# Altium schematic sheet HUB_USB.SchDoc
size A3; SheetNumber: 13; SheetTotal: 24
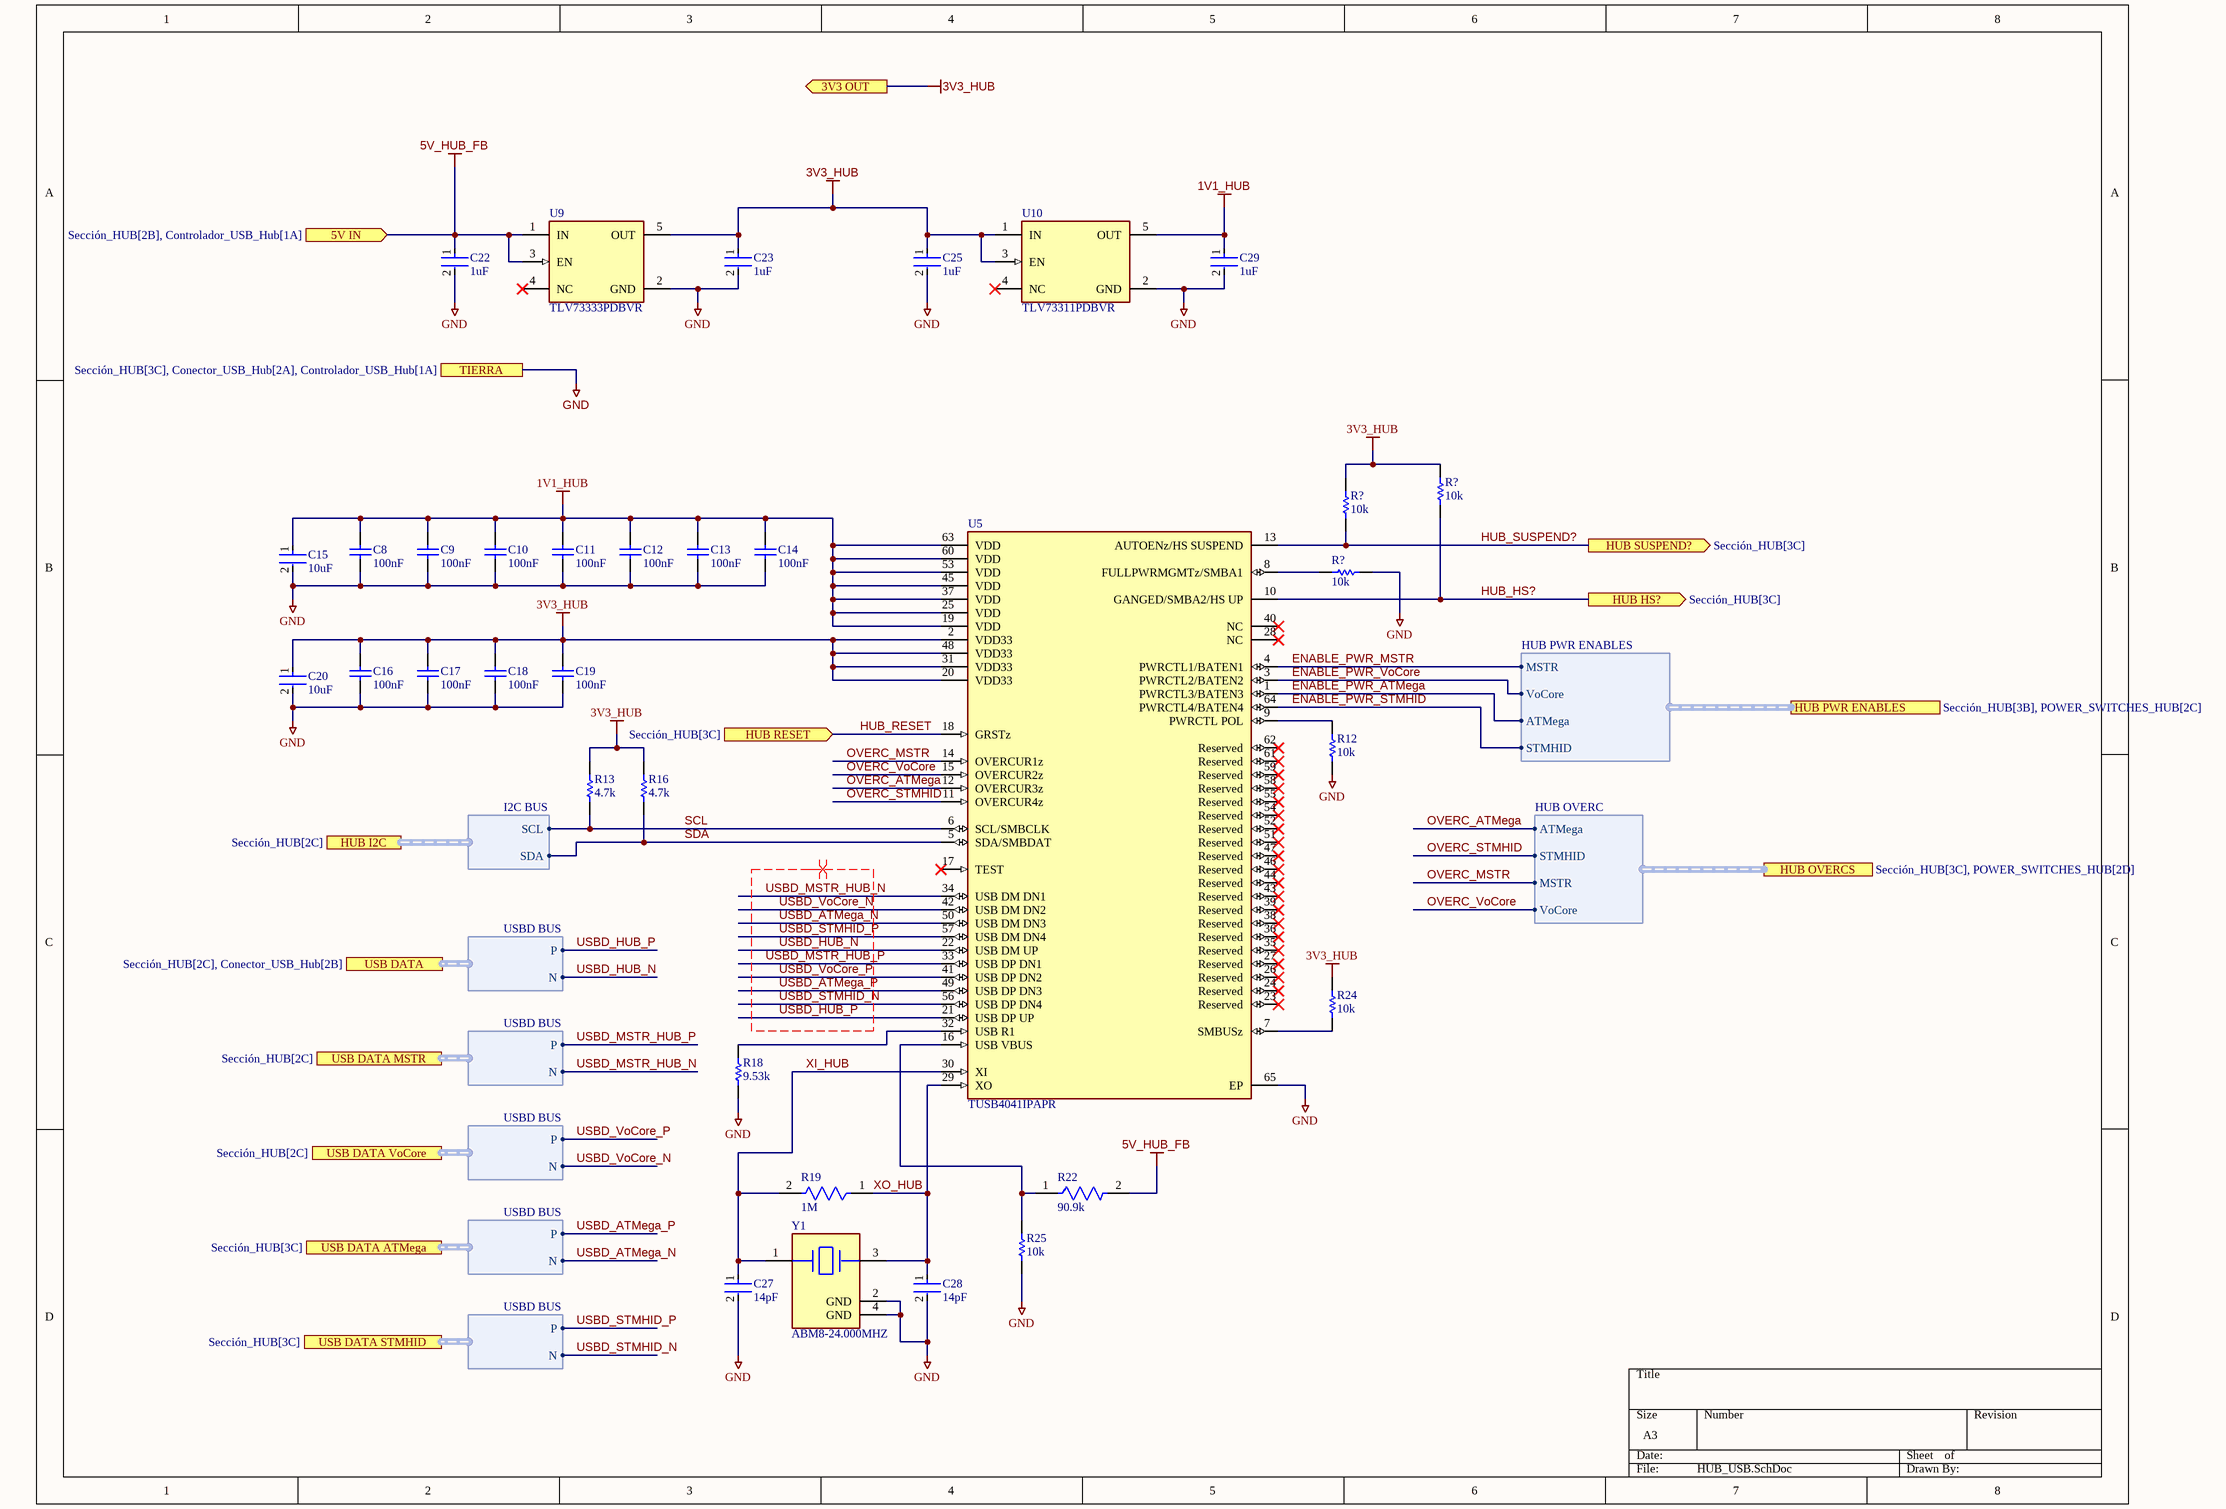
[diagram p0: HUB_USB.SchDoc]

## Parts
(Parts that share a designator on the sheet are numbered #1, #2 ... from top to bottom, then left to right.)
C8  100nF  [CAPC1005X55X25NL05T05]
C9  100nF  [CAPC1005X55X25NL05T05]
C10  100nF  [CAPC1005X55X25NL05T05]
C11  100nF  [CAPC1005X55X25NL05T05]
C12  100nF  [CAPC1005X55X25NL05T05]
C13  100nF  [CAPC1005X55X25NL05T05]
C14  100nF  [CAPC1005X55X25NL05T05]
C15  10uF  [FP-GRM155-0_2-MFG]
C16  100nF  [CAPC1005X55X25NL05T05]
C17  100nF  [CAPC1005X55X25NL05T05]
C18  100nF  [CAPC1005X55X25NL05T05]
C19  100nF  [CAPC1005X55X25NL05T05]
C20  10uF  [FP-GRM155-0_2-MFG]
C22  1uF  [FP-C0402C-BB-IPC_B]
C23  1uF  [FP-C0402C-BB-IPC_B]
C25  1uF  [FP-C0402C-BB-IPC_B]
C27  14pF  [FP-GJM155-0_05-IPC_C]
C28  14pF  [FP-GJM155-0_05-IPC_C]
C29  1uF  [FP-C0402C-BB-IPC_B]
R12  10k  [RESC1005X40X25NL05T05]
R13  4.7k  [RESC1005X40X25ML05T10]
R16  4.7k  [RESC1005X40X25ML05T10]
R18  9.53k  [RESC1609X50X30NL10T20]
R19  1M  [FP-CRCW0402-C-e3-IPC_B]
R22  90.9k  [FP-RK73H1E-IPC_C]
R24  10k  [RESC1005X40X25NL05T05]
R25  10k  [RESC1005X40X25NL05T05]
R?#1  10k  [RESC1005X40X25ML05T05]
R?#2  10k  [RESC1005X40X25ML05T05]
R?#3  10k  [RESC1005X40X25ML05T05]
U5  TUSB4041IPAPR  [FP-PAP0064K-MFG]
U9  TLV73333PDBVR  [FP-DBV0005A-MFG]
U10  TLV73311PDBVR  [FP-DBV0005A-IPC_C]
Y1  ABM8-24.000MHZ  [FP-ABM8-MFG]

## Ports
3V3 OUT (out), 5V IN (in, see Sección_HUB[2B], Controlador_USB_Hub[1A]), HUB HS? (out, see Sección_HUB[3C]), HUB I2C (harness I2C BUS, see Sección_HUB[2C]), HUB OVERCS (harness HUB OVERC, see Sección_HUB[3C], POWER_SWITCHES_HUB[2D]), HUB PWR ENABLES (harness HUB PWR ENABLES, see Sección_HUB[3B], POWER_SWITCHES_HUB[2C]), HUB RESET (in, see Sección_HUB[3C]), HUB SUSPEND? (out, see Sección_HUB[3C]), TIERRA (see Sección_HUB[3C], Conector_USB_Hub[2A], Controlador_USB_Hub[1A]), USB DATA (harness USBD BUS, see Sección_HUB[2C], Conector_USB_Hub[2B]), USB DATA ATMega (harness USBD BUS, see Sección_HUB[3C]), USB DATA MSTR (harness USBD BUS, see Sección_HUB[2C]), USB DATA STMHID (harness USBD BUS, see Sección_HUB[3C]), USB DATA VoCore (harness USBD BUS, see Sección_HUB[2C])

## Harnesses
I2C BUS: SDA, SCL
HUB PWR ENABLES: ATMega, STMHID, MSTR, VoCore
HUB OVERC: ATMega, STMHID, MSTR, VoCore
USBD BUS: P, N

## Nets
1V1_HUB: C8.2 C9.2 C10.2 C11.2 C12.2 C13.2 C14.2 C15.1 C29.1 U5.19(VDD) U5.25(VDD) U5.37(VDD) U5.45(VDD) U5.53(VDD) U5.60(VDD) U5.63(VDD) U10.5(OUT)
3V3_HUB: C16.2 C17.2 C18.2 C19.2 C20.1 C23.1 C25.1 R13.2 R16.2 R24.2 R?#1.2 R?#2.2 U5.2(VDD33) U5.20(VDD33) U5.31(VDD33) U5.48(VDD33) U9.5(OUT) U10.1(IN) U10.3(EN) ; port 3V3 OUT
5V_HUB_FB: C22.1 R22.2 U9.1(IN) U9.3(EN) ; port 5V IN
GND: C8.1 C9.1 C10.1 C11.1 C12.1 C13.1 C14.1 C15.2 C16.1 C17.1 C18.1 C19.1 C20.2 C22.2 C23.2 C25.2 C27.2 C28.2 C29.2 R12.1 R18.1 R25.1 R?#3.1 U5.65(EP) U9.2(GND) U10.2(GND) Y1.2(GND) Y1.4(GND) ; port TIERRA
ENABLE_PWR_ATMega: U5.1(PWRCTL3/BATEN3) ; port HUB PWR ENABLES.ATMega
ENABLE_PWR_MSTR: U5.4(PWRCTL1/BATEN1) ; port HUB PWR ENABLES.MSTR
ENABLE_PWR_STMHID: U5.64(PWRCTL4/BATEN4) ; port HUB PWR ENABLES.STMHID
ENABLE_PWR_VoCore: U5.3(PWRCTL2/BATEN2) ; port HUB PWR ENABLES.VoCore
HUB_HS?: R?#1.1 U5.10(GANGED/SMBA2/HS_UP) ; port HUB HS?
HUB_RESET: U5.18(GRSTz) ; port HUB RESET
HUB_SUSPEND?: R?#2.1 U5.13(AUTOENz/HS_SUSPEND) ; port HUB SUSPEND?
OVERC_ATMega: U5.12(OVERCUR3z) ; port HUB OVERCS.ATMega
OVERC_MSTR: U5.14(OVERCUR1z) ; port HUB OVERCS.MSTR
OVERC_STMHID: U5.11(OVERCUR4z) ; port HUB OVERCS.STMHID
OVERC_VoCore: U5.15(OVERCUR2z) ; port HUB OVERCS.VoCore
SCL: R13.1 U5.6(SCL/SMBCLK) ; port HUB I2C.SCL
SDA: R16.1 U5.5(SDA/SMBDAT) ; port HUB I2C.SDA
USBD_ATMega_N: U5.50(USB_DM_DN3) ; port USB DATA ATMega.N
USBD_ATMega_P: U5.49(USB_DP_DN3) ; port USB DATA ATMega.P
USBD_HUB_N: U5.22(USB_DM_UP) ; port USB DATA.N
USBD_HUB_P: U5.21(USB_DP_UP) ; port USB DATA.P
USBD_MSTR_HUB_N: U5.34(USB_DM_DN1) ; port USB DATA MSTR.N
USBD_MSTR_HUB_P: U5.33(USB_DP_DN1) ; port USB DATA MSTR.P
USBD_STMHID_N: U5.56(USB_DP_DN4) ; port USB DATA STMHID.N
USBD_STMHID_P: U5.57(USB_DM_DN4) ; port USB DATA STMHID.P
USBD_VoCore_N: U5.42(USB_DM_DN2) ; port USB DATA VoCore.N
USBD_VoCore_P: U5.41(USB_DP_DN2) ; port USB DATA VoCore.P
XI_HUB: C27.1 R19.2 U5.30(XI) Y1.1
XO_HUB: C28.1 R19.1 U5.29(XO) Y1.3
NetR12_2: R12.2 U5.9(PWRCTL_POL)
NetR18_2: R18.2 U5.32(USB_R1)
NetR22_1: R22.1 R25.2 U5.16(USB_VBUS)
NetR24_1: R24.1 U5.7(SMBUSz)
NetR?#3_2: R?#3.2 U5.8(FULLPWRMGMTz/SMBA1)

Not connected (* = marked no-connect by the designer): U5 17(TEST)* 23(Reserved)* 24(Reserved)* 26(Reserved)* 27(Reserved)* 28(NC)* 35(Reserved)* 36(Reserved)* 38(Reserved)* 39(Reserved)* 40(NC)* 43(Reserved)* 44(Reserved)* 46(Reserved)* 47(Reserved)* 51(Reserved)* 52(Reserved)* 54(Reserved)* 55(Reserved)* 58(Reserved)* 59(Reserved)* 61(Reserved)* 62(Reserved)*; U9 4(NC)*; U10 4(NC)*

## Layout directives
differential pair: USBD_ATMega_N, USBD_ATMega_P, USBD_HUB_N, USBD_HUB_P, USBD_MSTR_HUB_N, USBD_MSTR_HUB_P, USBD_STMHID_N, USBD_STMHID_P, USBD_VoCore_N, USBD_VoCore_P

## Library data of the parts
C8-C14 C16-C19 = CMP-2008-02030-1: Manufacturer: Vitramon; Part Number: VJ0402Y104KXJCW1BC
C15 C20 = CMP-06035-002770-1: Chip Multilayer Ceramic Capacitors for General Purpose, 0402, 10uF, X5R, 15%, 20%, 4V
C22 C23 C25 C29 = CMP-03020-034679-1: CAP CER 1UF 16V X5R 0402; Dielectric Material: Ceramic; Tolerance: 10%; RoHS Compliant: Yes; Voltage Rating (DC): 16V; Voltage Rating: 16V; Max Operating Temperature: 85°C; Packaging: Cut Tape; Width: 0.02inch; Dielectric: X5R; Lead Free: Lead Free; Min Operating Temperature: -55°C; Mount: Surface Mount; Case/Package: 0402; Thickness: 0.022inch; REACH SVHC: No SVHC; Length: 0.039inch; Case Code (Metric): 1005; Case Code (Imperial): 0402; Capacitance: 1uF
C27 C28 = CMP-06035-029519-1: Multi-Layer Ceramic Capacitor 14pF C0G  ±1% 0402 Paper T/R
R12 R24 R25 R?#1-R?#3 = CMP-2002-00601-1: Manufacturer: Panasonic; Part Number: ERJ-2RHD1002X
R13 R16 = CMP-2002-06456-1: Manufacturer: Panasonic; Part Number: ERJ-S02F4701X
R18 = CMP-2000-03655-1: Manufacturer: Vishay Dale; Part Number: CRCW06039K53FKEA
R19 = CMP-02407-013080-1: RES 1M OHM 1% 1/16W 0402; Max Power Dissipation: 63mW; Temperature Coefficient: 100ppm/°C; Power Rating: 62.5mW; Resistance: 1MR; Tolerance: 1%; Contact Plating: Tin; Max Operating Temperature: 155°C; Number of Terminations: 2; Min Operating Temperature: -55°C; Lead Free: Lead Free; Length: 1mm; RoHS Compliant: Yes; Series: CRCW-C; Case/Package: 0402; Packaging: Tape and Reel; Mount: Surface Mount; Resistor Type: Thick Film; Termination: Wraparound
R22 = CMP-04015-083698-1: 90.9kΩ ±1% 0.1W Chip Resistor 0402 Flat Chip (Anti-Sulfuration) AEC-Q200 Qualified; Voltage Rating: 50V; Resistance: 90.9kR; Power Rating: 63mW; Temperature Coefficient: 100ppm/°C; Case Code (Metric): 1005; Tolerance: 1%; Case/Package: 0402; Width: 0.5mm; Case Code (Imperial): 0402; Height: 0.35mm; Weight: 2.3E-05oz; Min Operating Temperature: -55°C; Length: 1mm; RoHS Compliant: Yes; Termination: SMD/SMT; Max Operating Temperature: 155°C; Packaging: Tape and Reel; Package Quantity: 10000
U5 = CMP-04877-000003-1: IC USB 2.0 4PORT HUB 64HTQFP; Manufacturer: Texas Instruments; Interface: I2C,USB,SMBus; Max Supply Voltage: 3.6V; Nominal Supply Current: 15uA; Standoff Height: 0.05mm; Min Supply Voltage: 0.99V; Usb Standard: USB 2.0; Number Of Ports: 4; Max Junction Temp: +105°C; Data Rate: 480Mbits/s; Temperature: -40°C to +85°C; ComponentLink2Description: Datasheet; Category: IC; Device Class L3: USB Interface ICs; Device Class L2: Interface ICs; Height: 1.2mm; ComponentLink2URL: http://www.ti.com/lit/ds/symlink/tusb4041i.pdf; Ipc Land Pattern Name: QFP50P1200X1200X120-64; Temperature Range High: +85°C; Lead Free: Yes; Manufacturer Part Number: TUSB4041IPAPR; Temperature Range Low: -40°C; RoHS: TRUE; Digikey Description: IC USB 2.0 4PORT HUB 64HTQFP; Device Class L1: Integrated Circuits (ICs); Ambient Temperature Range Low: -40°C; Automotive: No; Package: PAP0064K; Octopart: https://octopart.com/tusb4041ipapr-texas+instruments-61734371; Ambient Temperature Range High: +85°C
U9 = CMP-04917-000053-1: IC REG LINEAR 3.3V 300MA SOT23-5; Manufacturer: Texas Instruments; Max Junction Temp: +125°C; Accuracy Percentage: 1%; Min Supply Voltage: 1.4V; Number Of Outputs: 1; Dropout Voltage: 125mV; Nominal Supply Current: 34uA; Max Supply Voltage: 5.5V; Output Type: Fixed; Standoff Height: 0mm; Digikey Description: IC REG LINEAR 3.3V 300MA SOT23-5; Manufacturer Part Number: TLV73333PDBVR; Temperature Range High: +125°C; Temperature: -40°C to +125°C; Output Current: 300mA; Mouser Description: LDO Voltage Regulators Capacitr-Free 300-mA 5-SOT-23 -40 to 125; Automotive: No; Height: 1.45mm; Device Class L3: Voltage Regulators - Linear; ComponentLink2Description: Datasheet; Device Class L1: Integrated Circuits (ICs); ComponentLink2URL: http://www.ti.com/lit/ds/symlink/tlv733p.pdf; Octopart: https://octopart.com/tlv73333pdbvr-texas+instruments-51080890; Temperature Range Low: -40°C; RoHS: TRUE; Lead Free: Yes; Output Voltage: 3.3V; Package: DBV0005A; Device Class L2: Power Management ICs; Category: IC
U10 = CMP-04917-000331-1: IC REG LINEAR 1.1V 300MA SOT23-5; Number of Regulators: 1; Quiescent Current: 34uA; Max Input Voltage: 5.5V; Min Input Voltage: 1.4V; Polarity: Positive; Power Supply Rejection Ratio (PSRR): 28dB; Output Type: Fixed; Accuracy: 1%; Dropout Voltage: 122mV; Min Current Limit: 360mA; Mount: Surface Mount; Number of Pins: 5; Case/Package: SOT-23-5; Max Output Current: 300mA; Min Operating Temperature: -40°C; Lead Free: Lead Free; Output Current: 300mA; Output Voltage: 1.1V; RoHS Compliant: Yes; Package Quantity: 3000; Number of Outputs: 1; Packaging: Tape and Reel; Contact Plating: Gold; Weight: 0.000557oz; Max Operating Temperature: 125°C
Y1 = CMP-27762-000457-1: Crystal 24MHz ±10ppm 12pF SMD-4 3.2mm x 2.5mm